# EAGLE schematic Prelim (EAGLE 9.0.1)
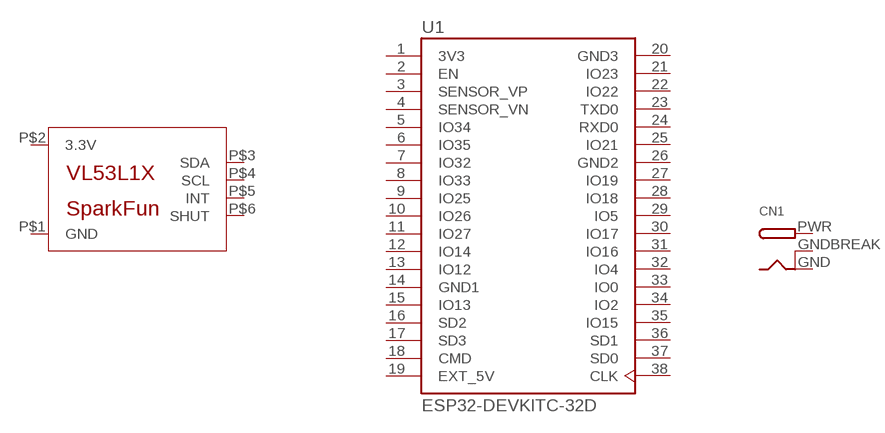
[diagram p0: schematic, sheet 1]

## Parts
CN1  DCBARRELPTH  [DCJACK_2MM_PTH]
U1  ESP32-DEVKITC-32D  [MODULE_ESP32-DEVKITC-32D]
U$1  QWIIC_STIANCE_SENSOR_VL53L1X  [QWIIC_DISTANCE_SENSOR_VL53L1X]
Unconnected: U1.2(EN) U1.3(SENSOR_VP) U1.4(SENSOR_VN) U1.5(IO34) U1.6(IO35) U1.7(IO32) U1.8(IO33) U1.9(IO25) U1.10(IO26) U1.11(IO27) U1.12(IO14) U1.13(IO12) U1.15(IO13) U1.16(SD2) U1.17(SD3) U1.18(CMD) U1.21(IO23) U1.22(IO22) U1.23(TXD0) U1.24(RXD0) U1.25(IO21) U1.27(IO19) U1.28(IO18) U1.29(IO5) U1.30(IO17) U1.31(IO16) U1.32(IO4) U1.33(IO0) U1.34(IO2) U1.35(IO15) U1.36(SD1) U1.37(SD0) U1.38(CLK) U$1.P$1(GND) U$1.P$2(3.3V) U$1.P$3(SDA) U$1.P$4(SCL) U$1.P$5(INT) U$1.P$6(SHUT)

## Power pins joined to a net without a drawn wire
3V3: U1.1(3V3)
EXT_5V: U1.19(EXT_5V)
GND: CN1.GND
GND1: U1.14(GND1)
GND2: U1.26(GND2)
GND3: U1.20(GND3)
GNDBREAK: CN1.GNDBREAK
PWR: CN1.PWR

## Library data of the parts
CN1 = adafruit:DCBARREL: 2.0mm DC Barrel Jack DCJACK_2MM_PTH - Through Hole Jack (4UConnector: 05537)
U1 = ESP32-DEVKITC-32D:ESP32-DEVKITC-32D: Eval Board For Esp-Wroom-32; AVAILABILITY: Unavailable; DESCRIPTION: - Transceiver; 802.11 b/g/n _Wi-Fi, WiFi, WLAN_, Bluetooth® Smart Ready 4.x Dual Mode For Use With ESP-WROOM-32; MF: Espressif Systems; MP: ESP32-DEVKITC-32D; PACKAGE: None; PRICE: None
U$1 = Qwiic_Distance_Sensor_VL53L1X:QWIIC_STIANCE_SENSOR_VL53L1X